# EAGLE design m1k-filter-mod-d1 (EAGLE 7.7.0)
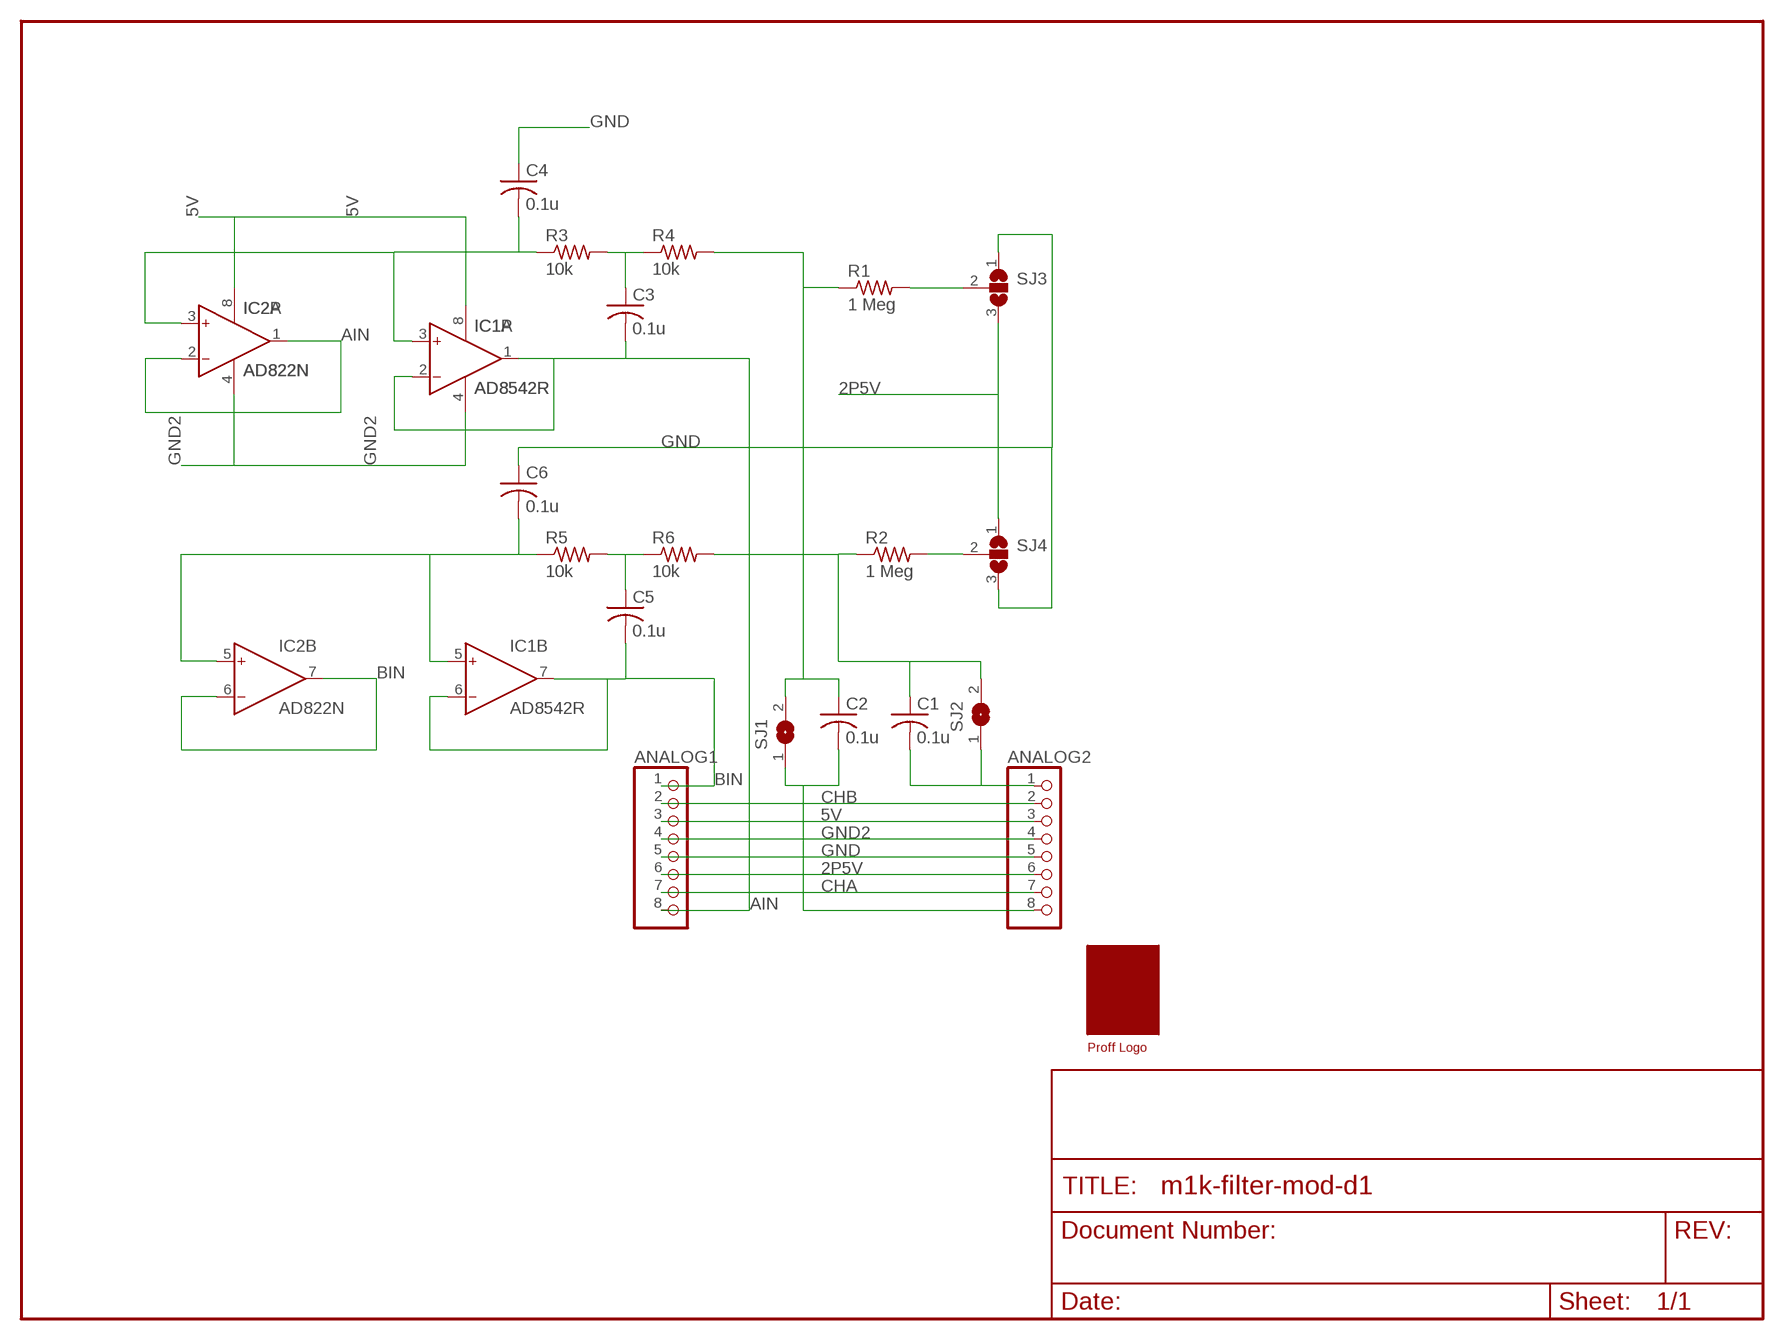
[diagram p0: schematic, sheet 1]

## Parts
ANALOG1  PINHD-1X8  [1X08]
ANALOG2  PINHD-1X8  [1X08]
C1  0.1u  C-US050-024X044  [C050-024X044]
C2  0.1u  C-US050-024X044  [C050-024X044]
C3  0.1u  C-US050-024X044  [C050-024X044]
C4  0.1u  C-US050-024X044  [C050-024X044]
C5  0.1u  C-US050-024X044  [C050-024X044]
C6  0.1u  C-US050-024X044  [C050-024X044]
IC1  AD8542R  [SO8]
IC2  AD822N  [DIL08]
R1  1 Meg  R-US_0204/7  [0204/7]
R2  1 Meg  R-US_0204/7  [0204/7]
R3  10k  R-US_0204/7  [0204/7]
R4  10k  R-US_0204/7  [0204/7]
R5  10k  R-US_0204/7  [0204/7]
R6  10k  R-US_0204/7  [0204/7]
SJ1  SJ  [SJ]
SJ2  SJ  [SJ]
SJ3  SJ2W  [SJ_2]
SJ4  SJ2W  [SJ_2]
U$1  PROFF  [PROFF]

## Nets
2P5V: ANALOG1.6 ANALOG2.6 SJ3.3 SJ4.1
5V: ANALOG1.3 ANALOG2.3 IC1.8(P:V+) IC2.8(P:V+)
AIN: ANALOG1.8 C3.2 IC1.1(A:OUT) IC1.2(A:IN-) IC2.1(A:OUT) IC2.2(A:IN-)
BIN: ANALOG1.1 C5.2 IC1.6(B:IN-) IC1.7(B:OUT) IC2.6(B:IN-) IC2.7(B:OUT)
CHA: ANALOG1.7 ANALOG2.7
CHB: ANALOG1.2 ANALOG2.2
GND: ANALOG1.5 ANALOG2.5 C4.1 C6.1 SJ3.1 SJ4.3
GND2: ANALOG1.4 ANALOG2.4 IC1.4(P:V-) IC2.4(P:V-)
N$1: ANALOG2.1 C1.2 SJ2.1
N$2: R1.2 SJ3.2
N$3: ANALOG2.8 C2.2 SJ1.1
N$4: C3.1 R3.2 R4.1
N$5: C2.1 R1.1 R4.2 SJ1.2
N$6: C1.1 R2.1 R6.2 SJ2.2
N$7: C6.2 IC1.5(B:IN+) IC2.5(B:IN+) R5.1
N$8: C5.1 R5.2 R6.1
N$9: C4.2 IC1.3(A:IN+) IC2.3(A:IN+) R3.1
N$10: R2.2 SJ4.2

## Library data of the parts
ANALOG1 ANALOG2 = pinhead:PINHD-1X8: PIN HEADER
C1-C6 = rcl:C-US: CAPACITOR, American symbol
IC1 = analog-devices:AD8542: General-Purpose CMOS Rail-to-Rail Amplifiers Source: http://www.analog.com/static/imported-files/data_sheets/AD8541_8542_8544.pdf; MF: ALTERA CORPORATION; MPN: AD8542ARZ-REEL; OC_FARNELL: 1424150; OC_NEWARK: 59K6827
IC2 = analog-devices:AD822: Single-Supply, Rail-to-Rail Low Power FET-Input Op Amp Source: http://www.analog.com/static/imported-files/data_sheets/AD822.pdf; OC_FARNELL: 1438581; OC_NEWARK: unknown
R1-R6 = resistor:R-US_: RESISTOR, American symbol
SJ1 SJ2 = jumper:SJ: SMD solder JUMPER
SJ3 SJ4 = jumper:SJ2W: SMD solder JUMPER
U$1 = logo:PROFF

## Board
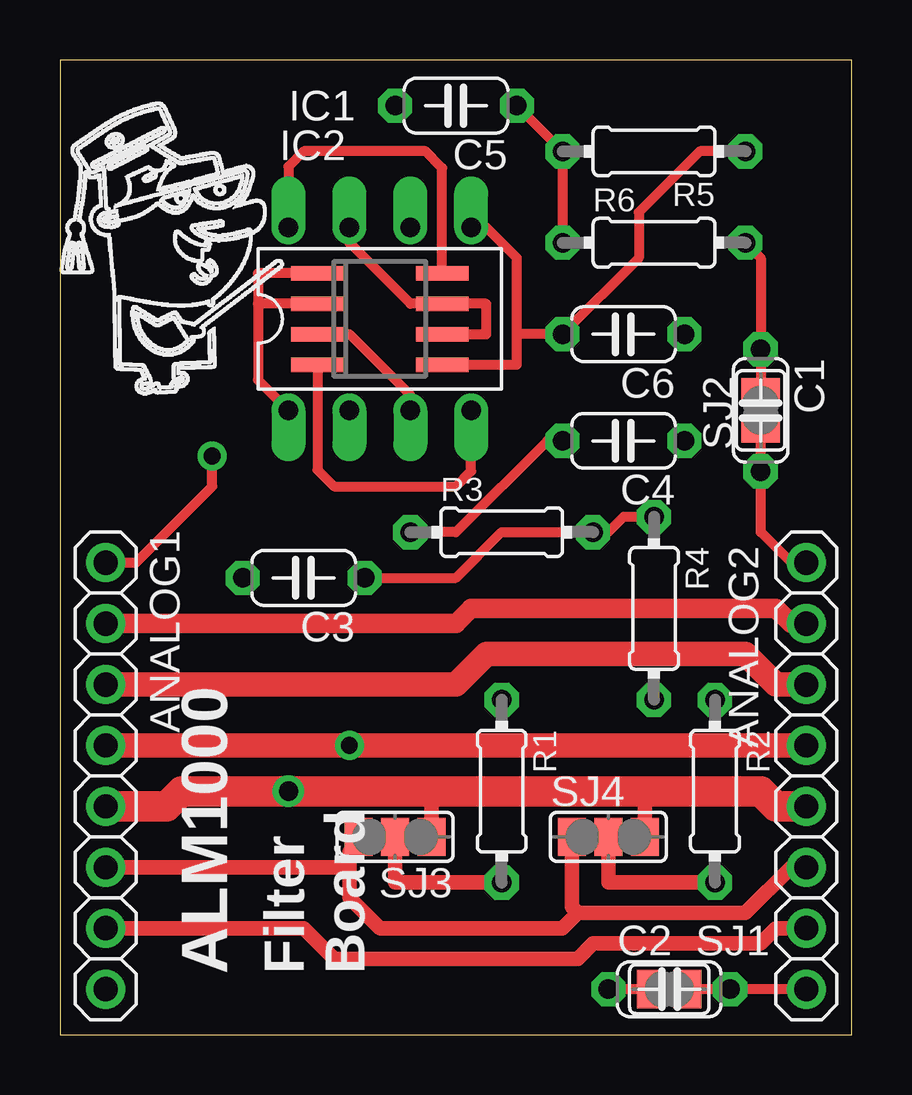
[diagram p1: board, top side]
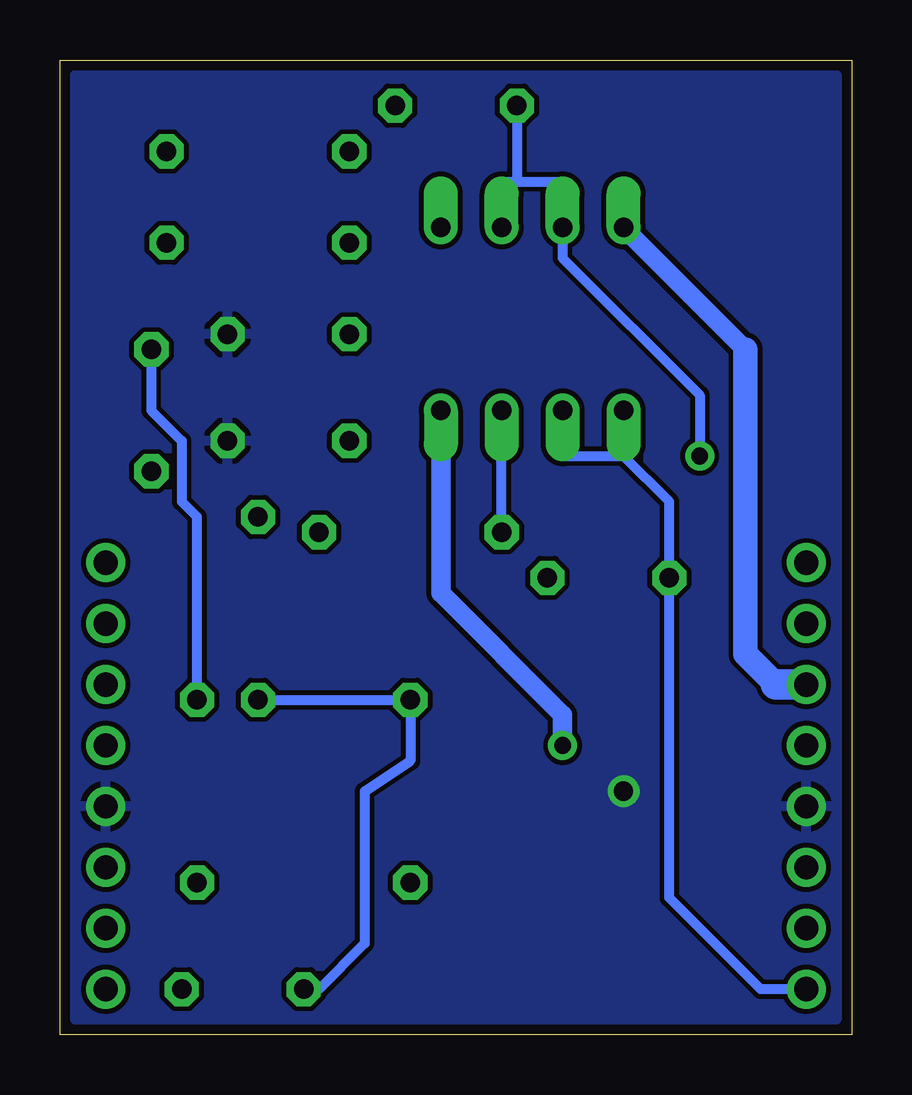
[diagram p2: board, bottom side, seen from below]

Size 33.02 x 40.64 mm. Coordinates in mm from the lower left corner, seen from the top.
Outline: 33.02,0 33.02,40.64 0,40.64 0,0 33.02,0
Copper layers (1*16): Top 0.035mm / dielectric 1.5mm / Bottom 0.035mm
Design rules "default": minimum track width 8mil, minimum drill 20mil, track to track 8mil, track to pad 8mil, pad to pad 8mil, via to via 8mil, smd to smd 8mil, copper to edge 8mil, drill to drill 8mil, minimum pad ring 12mil, minimum via ring 10mil, stop-mask expansion 4mil, vias tented up to drill 20mil, thermal gap 10mil

### Footprints (pad centres in the part's own frame; a part is rotated, then mirrored left to right if it is on the bottom)
1X08 = drill 1.016: 1 -8.89,0; 2 -6.35,0; 3 -3.81,0; 4 -1.27,0; 5 1.27,0; 6 3.81,0; 7 6.35,0; 8 8.89,0
C050-024X044 = drill 0.813 octagon: 1 -2.54,0; 2 2.54,0
SO8 = smd 0.6 x 2.2: 1 -1.905,-2.6; 2 -0.635,-2.6; 3 0.635,-2.6; 4 1.905,-2.6; 5 1.905,2.6; 6 0.635,2.6; 7 -0.635,2.6; 8 -1.905,2.6
DIL08 = drill 0.813 offset: 1 -3.81,-3.81; 2 -1.27,-3.81; 3 1.27,-3.81; 4 3.81,-3.81; 5 3.81,3.81; 6 1.27,3.81; 7 -1.27,3.81; 8 -3.81,3.81
0204/7 = drill 0.813 octagon: 1 -3.81,0; 2 3.81,0
SJ = smd 1.168 x 1.6: 1 -0.762,0; 2 0.762,0
SJ_2 = smd 1.168 x 1.6: 1 -1.524,0; 2 0,0; 3 1.524,0

### Placement (x,y rotation side)
ANALOG1  1.91,10.79 270 top
ANALOG2  31.11,10.79 270 top
C1  29.21,26.04 270 top
C2  25.4,1.91 0 top
C3  10.16,19.05 180 top
C4  23.5,24.77 180 top
C5  16.51,38.73 180 top
C6  23.5,29.21 180 top
IC1  13.34,29.84 270 top
IC2  13.34,29.84 0 top
R1  18.41,10.16 270 top
R2  27.3,10.16 270 top
R3  18.41,20.95 0 top
R4  24.77,17.78 270 top
R5  24.77,36.83 180 top
R6  24.77,33.02 0 top
SJ1  25.4,1.91 180 top
SJ2  29.21,26.04 90 top
SJ3  13.97,8.26 180 top
SJ4  22.86,8.26 0 top
U$1  0,26.67 0 top

### Tracks (layer width: path | path; a pad name or v marks a point on that pad's centre or on a via)
2P5V
  Top 0.61: ANALOG1.6 12.06,6.99 | SJ3.3 12.45,8 12.06,7.62 12.06,6.99 | 12.06,6.99 12.06,5.71 13.34,4.45 20.95,4.45 21.59,5.08 | 21.59,5.08 28.57,5.08 30.48,6.99 ANALOG2.6 | SJ4.1 21.34,5.33 21.59,5.08
5V
  Top 0.406: IC1.8 15.94,36.13 15.24,36.83 10.16,36.83 9.53,36.2 IC2.8
  Top 1.016: ANALOG1.3 16.51,14.61 17.78,15.88 28.57,15.88 29.84,14.61 ANALOG2.3
  Bottom 0.813: 4.45,28.57 IC2.8
  Bottom 1.016: 3.17,14.61 4.45,15.88 4.45,28.57
  Bottom 1.27: 3.17,14.61 ANALOG1.3
AIN
  Top 0.406: IC1.2 8.26,30.48 | 8.26,30.48 8.26,27.3 IC2.1 | IC1.1 8.26,31.75 8.26,30.48
  Bottom 0.406: IC2.2 12.06,24.13 9.53,24.13 | ANALOG1.8 3.81,1.91 7.62,5.71 C3.2 7.62,22.23 9.53,24.13 | 9.53,24.13 IC2.1
BIN  (via drill 0.7)
  Top 0.406: ANALOG1.1 3.17,19.68 6.35,22.86 v6.35,24.13 | IC1.6 17.78,29.21 17.78,30.48 IC1.7 14.61,30.48 12.06,33.02 IC2.7
  Bottom 0.406: IC2.6 14.61,35.56 13.97,35.56 | v6.35,24.13 6.35,26.67 12.06,32.38 IC2.7 12.06,35.56 13.97,35.56 | C5.2 13.97,35.56
CHA
  Top 0.61: ANALOG1.7 10.16,4.45 11.43,3.17 21.59,3.17 22.23,3.81 29.21,3.81 29.84,4.45 ANALOG2.7
CHB
  Top 0.813: ANALOG1.2 16.51,17.14 17.14,17.78 29.84,17.78 30.48,17.14 ANALOG2.2
GND  (via drill 0.8)
  Top 0.61: SJ3.1 15.49,9.91 15.24,10.16 | SJ4.3 24.38,9.91 24.13,10.16
  Top 1.27: ANALOG1.5 4.45,9.53 5.08,10.16 v9.53,10.16 15.24,10.16 24.13,10.16 29.21,10.16 29.84,9.53 ANALOG2.5
  pour Bottom: 0.64,0.64 32.38,0.64 32.38,40.01 0.64,40.01
GND2  (via drill 0.7)
  Top 0.406: IC1.4 10.73,23.55 11.43,22.86 16.51,22.86 17.14,23.5 IC2.4
  Top 1.016: ANALOG1.4 v12.06,12.06 ANALOG2.4
  Bottom 0.813: IC2.4 17.14,18.41 12.06,13.34 v12.06,12.06
N$1
  Top 0.406: ANALOG2.1 30.48,19.68 29.21,20.95 C1.2 SJ2.1
N$2
  Top 0.61: SJ3.2 13.97,6.35 R1.2
N$3
  Top 0.406: ANALOG2.8 C2.2 SJ1.1
N$4
  Top 0.406: R4.1 23.5,21.59 22.86,20.95 R3.2 20.95,20.95 18.41,20.95 16.51,19.05 C3.1
N$5
  Top 0.406: SJ1.2 C2.1
  Bottom 0.406: C2.1 22.23,1.91 20.32,3.81 20.32,10.16 18.41,11.43 R1.1 R4.2
N$6
  Top 0.406: 29.34,26.67 SJ2.2 C1.1 29.21,32.38 R6.2
  Bottom 0.406: R2.1 27.3,21.59 27.94,22.23 27.94,24.77 29.21,26.04 C1.1
N$7
  Top 0.406: IC1.5 19.05,27.94 19.05,29.21 | 19.05,29.21 19.05,32.38 17.78,33.66 IC2.5 | 19.05,29.21 C6.2 24.13,32.38 24.13,34.29 26.67,36.83 R5.1
N$8
  Top 0.406: R6.1 R5.2 C5.1
N$9
  Top 0.406: IC1.3 12.06,29.21 14.61,26.67 IC2.3 | C4.2 20.32,24.77 16.51,20.95 R3.1
  Bottom 0.406: R3.1 IC2.3
N$10
  Top 0.61: SJ4.2 22.86,6.35 R2.2

### Text on the board
tPlace: ALM1000 | Filter / Board